# EAGLE design LightSwitch (EAGLE 9.1.3)
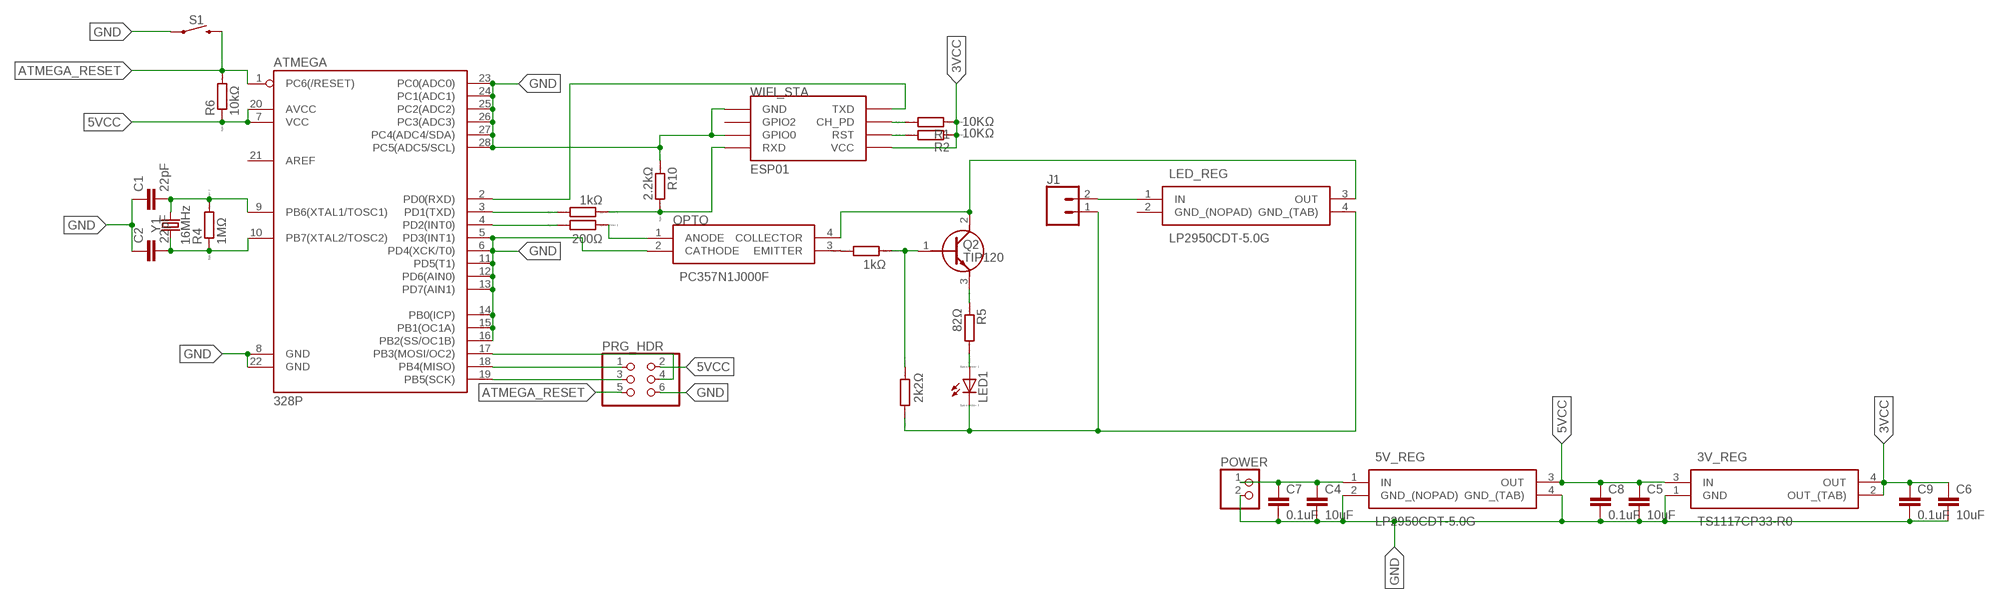
[diagram p0: schematic, sheet 1]

## Parts
3V_REG  TS1117CP33-R0  [TO229P990X238-4N]
5V_REG  LP2950CDT-5.0G  [TO229P990X238-4N]
ATMEGA  328P  ATMEGA328P_PDIP  [DIP28]
C1  22pF  1.0UF-1206-50V-10%  [1206]
C2  22pF  1.0UF-1206-50V-10%  [1206]
C4  10uF  1.0UF-1206-50V-10%  [1206]
C5  10uF  1.0UF-1206-50V-10%  [1206]
C6  10uF  1.0UF-1206-50V-10%  [1206]
C7  0.1uF  1.0UF-1206-50V-10%  [1206]
C8  0.1uF  1.0UF-1206-50V-10%  [1206]
C9  0.1uF  1.0UF-1206-50V-10%  [1206]
J1  CONN_025MM  [SCREWTERMINAL-5MM-2]
LED1  LED_ELD260  [LED_LD260]
LED_REG  LP2950CDT-5.0G  [TO229P990X238-4N]
OPTO  PC357N1J000F  [SOP254P675X300-4N]
POWER  PINHD-1X2  [1X02]
PRG_HDR  PINHD-2X3  [2X03]
Q2  TIP120  [TO220]
R1  10KΩ  RR1210  [R1210]
R2  10KΩ  RR1210  [R1210]
R3  200Ω  RR1210  [R1210]
R4  1MΩ  RR1210  [R1210]
R5  82Ω  RR1210  [R1210]
R6  10kΩ  RR1210  [R1210]
R7  1kΩ  RR1210  [R1210]
R8  2k2Ω  RR1210  [R1210]
R9  1kΩ  RR1210  [R1210]
R10  2.2kΩ  RR1210  [R1210]
S1  MOMENTARY-SWITCH-SPST-PTH-6.0MM  [TACTILE_SWITCH_PTH_6.0MM]
WIFI_STA  ESP01  [ESP01]
Y1  16MHz  CRYSTAL-8MHZSMD-HC49UP  [HC49UP]

## Nets
3VCC [power]: 3V_REG.2(OUT_(TAB)) 3V_REG.4(OUT) C6.1 C9.1 R1.1 R2.1 WIFI_STA.VCC
5VCC [power]: 3V_REG.3(IN) 5V_REG.3(OUT) ATMEGA.7(VCC) ATMEGA.20(AVCC) C5.1 C8.1 PRG_HDR.2 R6.1
AT_TXD: ATMEGA.3(PD1(TXD)) R9.2
ATMEGA_RESET: ATMEGA.1(PC6(/RESET)) PRG_HDR.5 R6.2 S1.3
GND [power]: 3V_REG.1(GND) 5V_REG.2(GND_(NOPAD)) 5V_REG.4(GND_(TAB)) ATMEGA.5(PD3(INT1)) ATMEGA.6(PD4(XCK/T0)) ATMEGA.8(GND) ATMEGA.11(PD5(T1)) ATMEGA.12(PD6(AIN0)) ATMEGA.13(PD7(AIN1)) ATMEGA.14(PB0(ICP)) ATMEGA.15(PB1(OC1A)) ATMEGA.16(PB2(SS/OC1B)) ATMEGA.22(GND) ATMEGA.23(PC0(ADC0)) ATMEGA.24(PC1(ADC1)) ATMEGA.25(PC2(ADC2)) ATMEGA.26(PC3(ADC3)) ATMEGA.27(PC4(ADC4/SDA)) ATMEGA.28(PC5(ADC5/SCL)) C1.1 C2.1 C4.2 C5.2 C6.2 C7.2 C8.2 C9.2 OPTO.2(CATHODE) POWER.2 PRG_HDR.6 R10.1 S1.1 WIFI_STA.GND WIFI_STA.GPIO0
LED_ANODE: LED1.A R5.2
LED_EN: ATMEGA.4(PD2(INT0)) R3.2
LED_GND [power]: J1.1 LED1.K(C) LED_REG.4(GND_(TAB)) R8.2
LED_VCC [power]: LED_REG.3(OUT) OPTO.4(COLLECTOR) Q2.2(C)
LED_VIN: J1.2 LED_REG.1(IN)
MISO: ATMEGA.18(PB4(MISO)) PRG_HDR.1
MOSI: ATMEGA.17(PB3(MOSI/OC2)) PRG_HDR.4
N$1: OPTO.3(EMITTER) R7.2
N$4: Q2.3(E) R5.1
OPTO_ANODE: OPTO.1(ANODE) R3.1
OPTO_EMITTER: Q2.1(B) R7.1 R8.1
SCK: ATMEGA.19(PB5(SCK)) PRG_HDR.3
STA_CH_PD: R1.2 WIFI_STA.CH_PD
STA_RST: R2.2 WIFI_STA.RST
STA_RXD: R9.1 R10.2 WIFI_STA.RX(RXD)
STA_TXD: ATMEGA.2(PD0(RXD)) WIFI_STA.TX(TXD)
VIN [power]: 5V_REG.1(IN) C4.1 C7.1 POWER.1
XTAL1: ATMEGA.9(PB6(XTAL1/TOSC1)) C1.2 R4.2 Y1.2
XTAL2: ATMEGA.10(PB7(XTAL2/TOSC2)) C2.2 R4.1 Y1.1
Unconnected: ATMEGA.21(AREF) WIFI_STA.GPIO2

## Power pins joined to a net without a drawn wire
GND_(NOPAD): LED_REG.2(GND_(NOPAD))

## Library data of the parts
3V_REG = TS1117CP33-R0:TS1117CP33-R0: Source: Datasheet <http://www.onsemi.com/pub/Collateral/LP2950-D.PDF>; ALLIED_NUMBER: 70100442; ALLIED_PRICE-STOCK: http://www.alliedelec.com/on-semiconductor-lp2950cdt-5-0g/70100442/; HEIGHT: 2.38mm; MANUFACTURER_NAME: ON Semiconductor; MANUFACTURER_PART_NUMBER: LP2950CDT-5.0G; MOUSER_PART_NUMBER: 863-LP2950CDT-5.0G; MOUSER_PRICE-STOCK: https://www.mouser.com/Search/Refine.aspx?Keyword=863-LP2950CDT-5.0G; RS_PART_NUMBER: 0463593P; RS_PRICE-STOCK: http://uk.rs-online.com/web/p/products/0463593P
5V_REG LED_REG = LP2950CDT-5.0G:LP2950CDT-5.0G: Source: Datasheet <http://www.onsemi.com/pub/Collateral/LP2950-D.PDF>; ALLIED_NUMBER: 70100442; ALLIED_PRICE-STOCK: http://www.alliedelec.com/on-semiconductor-lp2950cdt-5-0g/70100442/; HEIGHT: 2.38mm; MANUFACTURER_NAME: ON Semiconductor; MANUFACTURER_PART_NUMBER: LP2950CDT-5.0G; MOUSER_PART_NUMBER: 863-LP2950CDT-5.0G; MOUSER_PRICE-STOCK: https://www.mouser.com/Search/Refine.aspx?Keyword=863-LP2950CDT-5.0G; RS_PART_NUMBER: 0463593P; RS_PRICE-STOCK: http://uk.rs-online.com/web/p/products/0463593P
ATMEGA = SparkFun-IC-Microcontroller:ATMEGA328P_PDIP: Atmel 328P Through hole ATMEGA328P uC used in the Arduino 32kb flash, 1k EEPROM, 2k SRAM Datasheet <http://www.sparkfun.com/datasheets/Components/SMD/ATMega328.pdf> SparkFun Products Storefront component: AVR 28 Pin 20MHz 32K 6A/D - ATMega328P <https://www.sparkfun.com/products/9061> (COM-09061) SparkFun Simon Says - Through-Hole Soldering Kit <https://www.sparkfun.com/products/10547> (KIT-10547) SparkFun Learn to Solder - Simon Says <https://www.sparkfun.com/products/13708> (KIT-13708) SparkFun BigTime Watch Kit <https://www.sparkfun.com/products/11734> (KIT-11734) SparkFun ClockIt <https://www.sparkfun.com/products/10930> (KIT-10930) SparkFun Serial Enabled LCD Kit <https://www.sparkfun.com/products/10097> (LCD-10097) SparkFun Simon Tilts - Through Hole Soldering Kit <https://www.sparkfun.com/products/12634> (KIT-12634) SparkFun Frequency Counter Kit <https://www.sparkfun.com/products/10140> (KIT-10140) FabFM Radio Kit <https://www.sparkfun.com/products/11043> (KIT-11043) SparkFun Binary Blaster Kit <https://www.sparkfun.com/products/12037> (KIT-12037) SparkFun Metro-Gnome <https://www.sparkfun.com/products/9236> (KIT-09236) ATmega328 with Arduino Optiboot (Uno) <https://www.sparkfun.com/products/10524> (DEV-10524); PROD_ID: IC-09136
C1 C2 C4-C9 = SparkFun-Capacitors:1.0UF: 1µF ceramic capacitors A capacitor is a passive two-terminal electrical component used to store electrical energy temporarily in an electric field.; PROD_ID: CAP-09822; VALUE: 1.0uF
J1 = SparkFun-Connectors:CONN_02: Multi connection point. Often used as Generic Header-pin footprint for 0.1 inch spaced/style header connections On any of the 0.1 inch spaced packages, you can populate with these: Break Away Headers - Straight <https://www.sparkfun.com/products/116> (PRT-00116) Break Away Male Headers - Right Angle <https://www.sparkfun.com/products/553> (PRT-00553) Female Headers <https://www.sparkfun.com/products/115> (PRT-00115) Break Away Headers - Machine Pin <https://www.sparkfun.com/products/117> (PRT-00117) Break Away Female Headers - Swiss Machine Pin <https://www.sparkfun.com/products/743> (PRT-00743) For SCREWTERMINALS and SPRING TERMINALS visit here: Screw Terimnals on SparkFun.com <https://www.sparkfun.com/search/results?term=Screw+Terminals> (5mm/3.5mm/2.54mm spacing) This device is also useful as a general connection point to wire up your design to another part of your project. Our various solder wires solder well into these plated through hole pads. Hook-Up Wire - Assortment (Stranded, 22 AWG) <https://www.sparkfun.com/products/11375> (PRT-11375) Hook-Up Wire - Assortment (Solid Core, 22 AWG) <https://www.sparkfun.com/products/11367> (PRT-11367) View the entire wire category on our website here <https://www.sparkfun.com/categories/141> Special notes: Molex polarized connector foot print use with: PRT-08233 with associated crimp pins and housings. 2.54_SCREWTERM for use with PRT-10571. 3.5mm Screw Terminal footprints for PRT-08084 5mm Screw Terminal footprints for use with PRT-08432; SF_SKU: PRT-08432
LED1 = eagle-ltspice:LED_E: LED Source: http://www.osram.convergy.de Source: www.luxeon.com Source: www.kingbright.com; SPICEMODEL: NONE; SPICEPREFIX: D; SPICETYPE: diode
OPTO = PC357N1J000F:PC357N1J000F: Sharp, PC357N1J000F AC Input Transistor Output Optocoupler, Surface Mount, 4-Pin Mini-Flat Source: Datasheet <https://www.sharpsde.com/products/optoelectronic-components/model/PC357N1J000F/>; DESCRIPTION: Sharp, PC357N1J000F AC Input Transistor Output Optocoupler, Surface Mount, 4-Pin Mini-Flat; HEIGHT: 3mm; MANUFACTURER_NAME: Sharp Microelectronics; MANUFACTURER_PART_NUMBER: PC357N1J000F; MOUSER_PART_NUMBER: 852-PC357N1J000F; MOUSER_PRICE-STOCK: https://www.mouser.com/Search/Refine.aspx?Keyword=852-PC357N1J000F; RS_PART_NUMBER: 1460767; RS_PRICE-STOCK: http://uk.rs-online.com/web/p/products/1460767
POWER = pinhead:PINHD-1X2: PIN HEADER
PRG_HDR = pinhead:PINHD-2X3: PIN HEADER
Q2 = TIP120:TIP120: NPN Darlington Transistor Source: Datasheet <https://www.fairchildsemi.com/datasheets/TI/TIP120.pdf>; DESCRIPTION: NPN Darlington Transistor; HEIGHT: mm; MANUFACTURER_NAME: Fairchild Semiconductor; MANUFACTURER_PART_NUMBER: TIP120; MOUSER_PART_NUMBER: 512-TIP120; MOUSER_PRICE-STOCK: https://www.mouser.com/Search/Refine.aspx?Keyword=512-TIP120
R1-R10 = eagle-ltspice:R: RESISTOR, European symbol; SPICEMODEL: NONE; SPICEPREFIX: R
S1 = SparkFun-Switches:MOMENTARY-SWITCH-SPST: Momentary Switch (Pushbutton) - SPST Normally-open (NO) SPST momentary switches (buttons, pushbuttons). Variants PTH-12MM - 12mm square, through-hole Momentary Pushbutton Switch - 12mm Square <https://www.sparkfun.com/products/9190> (COM-09190) PTH-6.0MM, PTH-6.0MM-KIT - 6.0mm square, through-hole Mini Pushbutton Switch <https://www.sparkfun.com/products/97> (COM-00097) KIT package intended for soldering kit's - only one side of pads' copper is exposed. PTH-RIGHT-ANGLE-KIT - Right-angle, through-hole Right Angle Tactile Button <https://www.sparkfun.com/products/10791> - Used on SparkFun BigTime Watch Kit <https://www.sparkfun.com/products/11734> SMD-12MM - 12mm square, surface-mount Tactile Button - SMD (12mm) <https://www.sparkfun.com/products/12993> (COM-12993) Used on SparkFun PicoBoard <https://www.sparkfun.com/products/11888> SMD-4.5MM - 4.5mm Square Trackball Switch Used on SparkFun Blackberry Trackballer Breakout <https://www.sparkfun.com/products/13169> SMD-4.6MMX2.8MM - 4.60mm x 2.80mm, surface mount Used on SparkFun SAMD21 Mini Breakout <https://www.sparkfun.com/products/13664> SMD-5.2MM, SMD-5.2-REDUNDANT - 5.2mm square, surface-mount Mini Pushbutton Switch - SMD <https://www.sparkfun.com/products/8720> (COM-08720) Used on Arduino Pro Mini <https://www.sparkfun.com/products/11114> REDUNDANT package connects both switch circuits together SMD-6.0X3.5MM - 6.0 x 3.5mm, surface mount Momentary Reset Switch SMD <https://www.sparkfun.com/products/8229> (COM-08229) SMD-6.2MM-TALL - 6.2mm square, surface mount Tactile Button - SMD (6mm) <https://www.sparkfun.com/products/12992> Used on SparkFun Digital Sandbox <https://www.sparkfun.com/products/12651> SMD-RIGHT-ANGLE - Right-angle, surface mount Used on SparkFun Block for Intel® Edison - Arduino <https://www.sparkfun.com/products/13036>; PROD_ID: SWCH-08441; SF_SKU: COM-00097
WIFI_STA = esp8266modules:ESP01: ESP8266 Wifi module 01
Y1 = SparkFun-Clocks:CRYSTAL-8MHZ: 8MHz Crystal Datasheet Example <http://www.futureelectronics.com/en/technologies/electromechanical/timing-devices/crystals/Pages/6008189-ABM3B-8.000MHZ-B2-T.aspx?IM=0> Frequency: 8MHz Frequency Tolerance: ±20ppm Load Capacitance: 18pF SparkFun Products: Pro Micro -3.3V/8MHz <https://www.sparkfun.com/products/12587> WAV Trigger <https://www.sparkfun.com/products/13660>; PROD_ID: XTAL-11706; VALUE: 8MHz

## Net classes
0 default: width 0.406 mm, drill 0.203 mm, clearance 0.203 mm
1 power: width 0.813 mm, drill 0.203 mm, clearance 0.203 mm
2 text: width 0.203 mm, drill 0.203 mm, clearance 0.203 mm

## Board
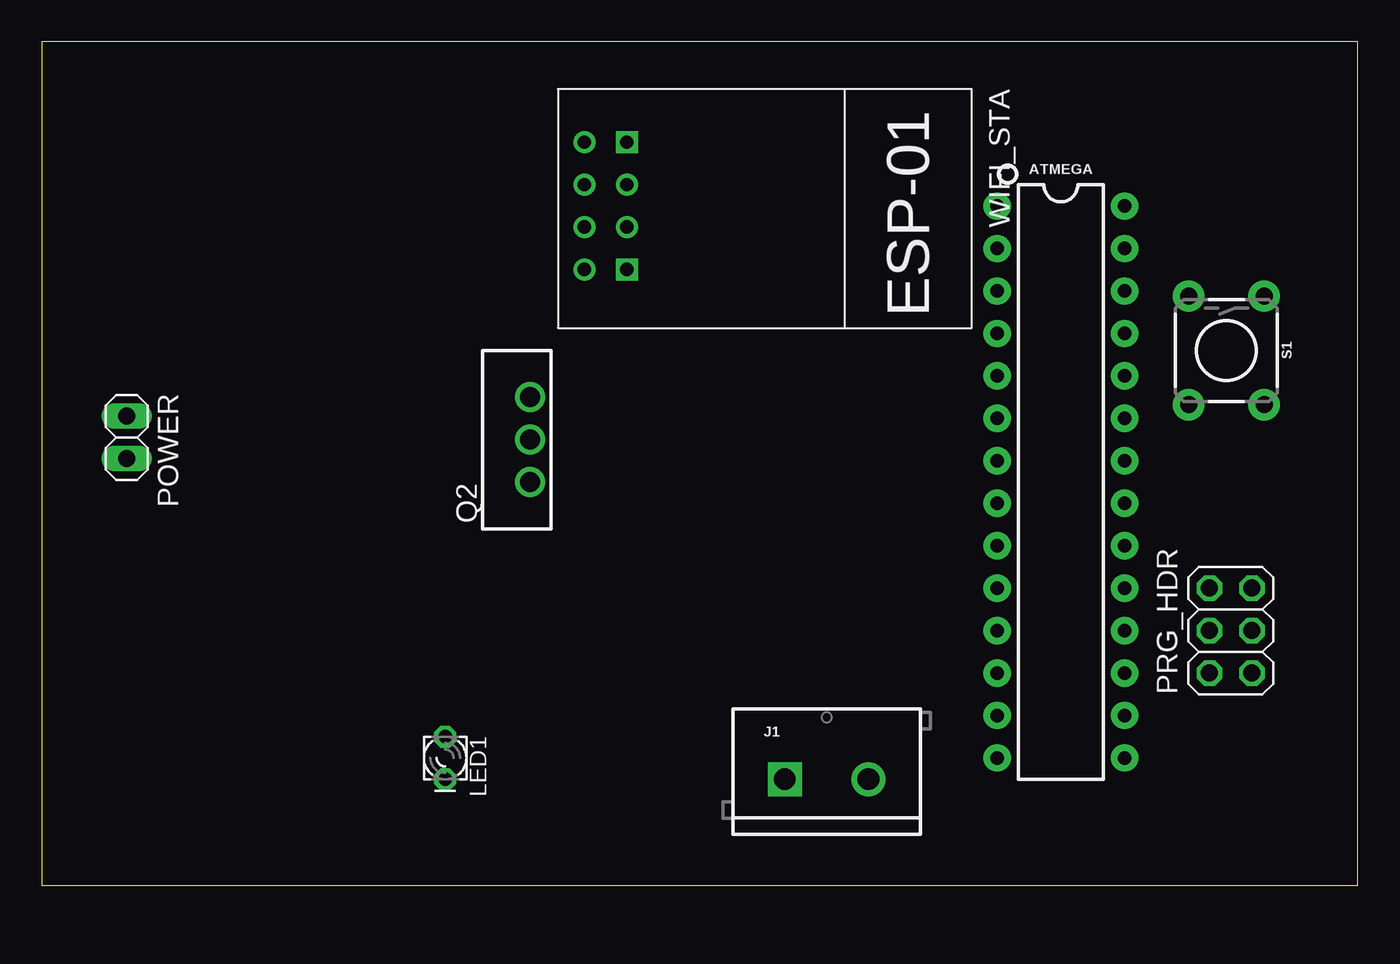
[diagram p1: board, top side]
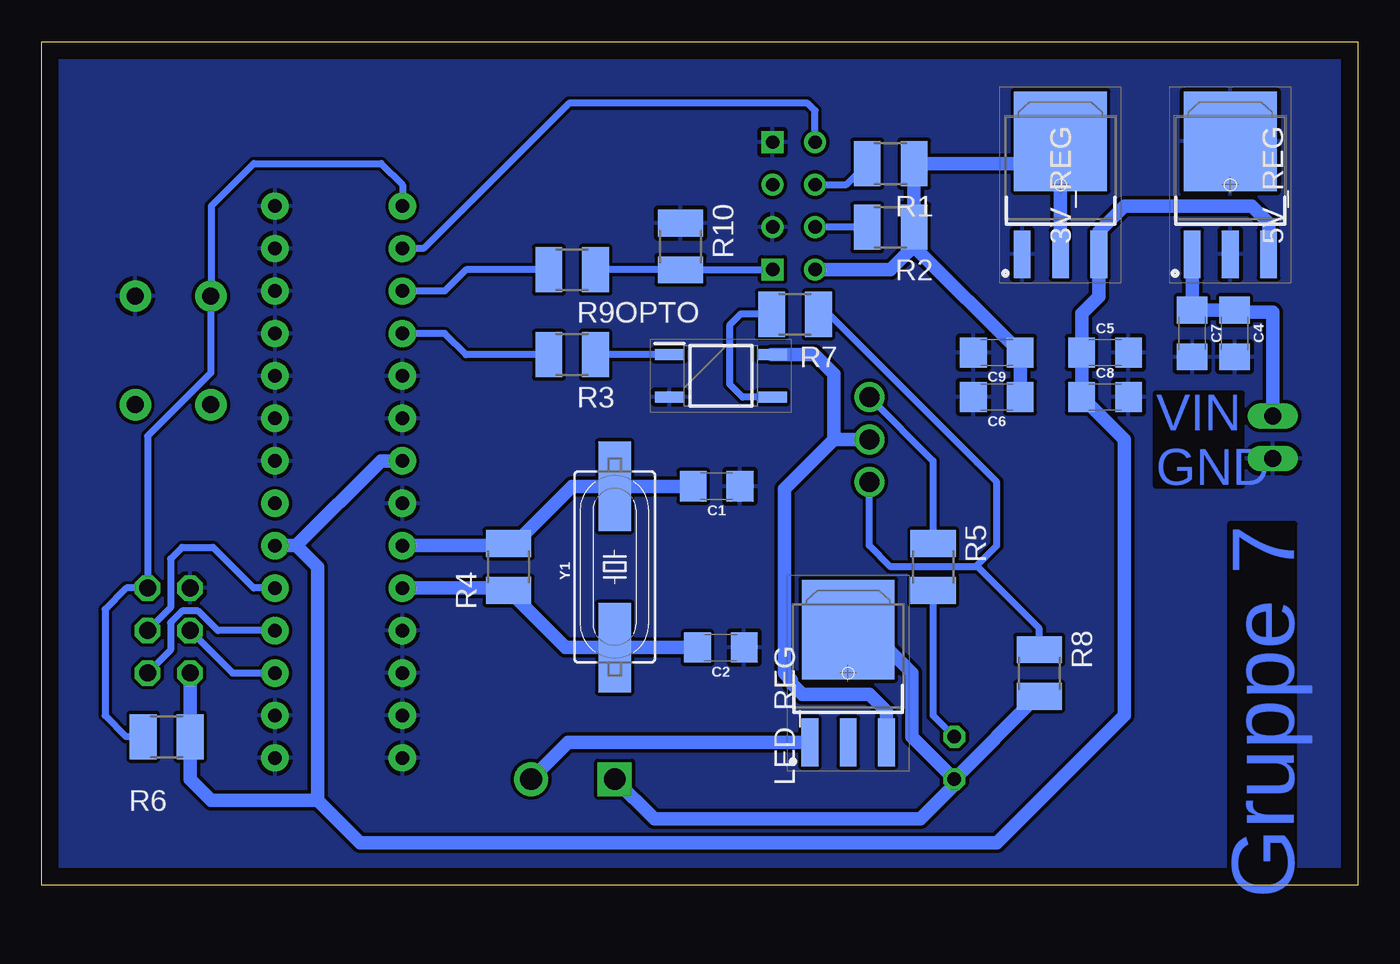
[diagram p2: board, bottom side, seen from below]

Size 78.72 x 50.47 mm. Coordinates in mm from the lower left corner, seen from the top.
Outline: 0,0 78.72,0 78.72,50.47 0,50.47 0,0
Copper layers (1*16): Top 0.035mm / dielectric 1.5mm / Bottom 0.035mm
Design rules "default *": minimum track width 6mil, minimum drill 0.35mm, track to track 6mil, track to pad 6mil, pad to pad 6mil, via to via 6mil, smd to smd 6mil, copper to edge 40mil, drill to drill 6mil, minimum pad ring 10mil, minimum via ring 8mil, stop-mask expansion 4mil, vias tented up to drill 0mil, thermal gap 10mil

### Footprints (pad centres in the part's own frame; a part is rotated, then mirrored left to right if it is on the bottom)
TO229P990X238-4N = smd 2.85 x 1: 1 -4.15,2.29; 2 -4.15,0; 3 -4.15,-2.29 | smd 5.95 x 5.55: 4 2.6,0
DIP28 = drill 0.813 pad 1.626: 1 -16.51,-3.81; 2 -13.97,-3.81; 3 -11.43,-3.81; 4 -8.89,-3.81; 5 -6.35,-3.81; 6 -3.81,-3.81; 7 -1.27,-3.81; 8 1.27,-3.81; 9 3.81,-3.81; 10 6.35,-3.81; 11 8.89,-3.81; 12 11.43,-3.81; 13 13.97,-3.81; 14 16.51,-3.81; 15 16.51,3.81; 16 13.97,3.81; 17 11.43,3.81; 18 8.89,3.81; 19 6.35,3.81; 20 3.81,3.81; 21 1.27,3.81; 22 -1.27,3.81; 23 -3.81,3.81; 24 -6.35,3.81; 25 -8.89,3.81; 26 -11.43,3.81; 27 -13.97,3.81; 28 -16.51,3.81
1206 = smd 1.6 x 1.8: 1 -1.4,0; 2 1.4,0
SCREWTERMINAL-5MM-2 = drill 1.3 pad 2.032 square: 1 0,0 | drill 1.3 pad 2.032: 2 5,0
LED_LD260 = drill 0.813 octagon: A -1.27,0; K 1.27,0
SOP254P675X300-4N = smd 1.75 x 0.65: 1 -3.075,1.27; 2 -3.075,-1.27; 3 3.075,-1.27; 4 3.075,1.27
1X02 = drill 1.016 long: 1 -1.27,0; 2 1.27,0
2X03 = drill 1.016 octagon: 1 -2.54,-1.27; 2 -2.54,1.27; 3 0,-1.27; 4 0,1.27; 5 2.54,-1.27; 6 2.54,1.27
TO220 = drill 1.2 pad 1.8: 1 -2.54,0; 2 0,0; 3 2.54,0
R1210 = smd 1.6 x 2.7: 1 -1.4,0; 2 1.4,0
TACTILE_SWITCH_PTH_6.0MM = drill 1.016 pad 1.88: 1 -3.251,2.261; 2 3.251,2.261; 3 -3.251,-2.261; 4 3.251,-2.261
ESP01 = drill 0.8: CH_PD -1.285,-8.178; GPIO0 1.255,-5.638; GPIO2 -1.285,-5.638; RST 1.255,-8.178; TX -3.825,-8.178; VCC 3.795,-8.178 | drill 0.8 square: GND -3.825,-5.638; RX 3.795,-5.638
HC49UP = smd 5.334 x 1.93: 1 -4.826,0; 2 4.826,0

### Placement (x,y rotation side)
3V_REG  17.78,41.91 90 bottom
5V_REG  7.62,41.91 90 bottom
ATMEGA  60.96,24.13 270 top
C1  38.35,23.88 180 bottom
C2  38.1,14.22 180 bottom
C4  7.37,33.02 270 bottom
C5  15.11,31.88 0 bottom
C6  21.59,29.21 180 bottom
C7  9.91,33.02 270 bottom
C8  15.11,29.21 0 bottom
C9  21.59,31.88 180 bottom
J1  44.45,6.35 0 top
LED1  24.13,7.62 270 top
LED_REG  30.48,12.7 90 bottom
OPTO  38.1,30.48 0 bottom
POWER  5.08,26.8 270 top
PRG_HDR  71.12,15.24 90 top
Q2  29.21,26.67 90 top
R1  27.94,43.18 180 bottom
R2  27.94,39.37 180 bottom
R3  46.99,31.75 180 bottom
R4  50.8,19.05 90 bottom
R5  25.4,19.05 270 bottom
R6  71.25,8.89 180 bottom
R7  33.66,34.16 180 bottom
R8  19.05,12.7 270 bottom
R9  46.99,36.83 180 bottom
R10  40.51,38.23 270 bottom
S1  70.87,32 270 top
WIFI_STA  40.64,40.64 270 top
Y1  44.45,19.05 90 bottom

### Tracks (layer width: path | path; a pad name or v marks a point on that pad's centre or on a via)
3VCC
  Bottom 0.813: 3V_REG.2 3V_REG.4 19.11,43.18 R1.1 R2.1 | C6.1 C9.1 26.54,38.23 R2.1 | R2.1 26.67,39.24 | WIFI_STA.VCC 32.45,36.83 27.94,36.83 26.54,38.23 R2.1
5VCC
  Bottom 0.813: 16.51,31.75 C8.1 13.97,26.67 13.97,10.16 21.59,2.54 59.69,2.54 62.23,5.08 | 16.51,31.75 C5.1 | ATMEGA.7 58.42,25.4 63.5,20.32 | ATMEGA.20 63.5,20.32 | 63.5,20.32 62.23,19.05 62.23,5.08 | 62.23,5.08 68.58,5.08 69.85,6.35 R6.1 PRG_HDR.2 | 16.51,31.75 16.51,34.2 15.49,35.22 3V_REG.3 15.49,39.12 13.97,40.64 6.35,40.64 5.33,39.62 5V_REG.3
AT_TXD
  Bottom 0.406: R9.2 53.34,36.83 54.61,35.56 ATMEGA.3
ATMEGA_RESET
  Bottom 0.406: ATMEGA.1 57.15,41.91 58.42,43.18 66.04,43.18 68.58,40.64 68.58,35.28 S1.3 68.61,30.66 72.39,26.87 PRG_HDR.5 73.66,17.78 74.93,16.51 74.93,10.16 73.66,8.89 R6.2
GND
  pour Bottom: 0,50.8 78.74,50.8 78.74,0 0,0
LED_ANODE
  Bottom 0.406: R5.2 25.4,10.16 LED1.A
LED_EN
  Bottom 0.406: R3.2 53.34,31.75 54.61,33.02 ATMEGA.4
LED_GND
  Bottom 0.813: LED1.K 19.18,11.3 R8.2 | J1.1 42.08,3.97 26.17,3.97 24.13,6.01 LED1.K | LED1.K 26.67,8.89 26.67,12.7 29.27,15.3 LED_REG.4
LED_VCC
  Bottom 0.813: 31.32,26.67 Q2.2 | OPTO.4 32.48,31.75 31.32,30.59 31.32,26.67 | LED_REG.3 28.19,10.41 29.21,11.43 33.22,11.43 33.86,12.07 33.86,12.28 34.29,12.7 34.29,23.7 31.32,26.67
LED_VIN
  Bottom 0.813: LED_REG.1 47.25,8.55 J1.2
MISO
  Bottom 0.406: ATMEGA.18 68.2,15.24 69.37,16.41 70.33,16.41 71.02,15.72 71.02,14.07 PRG_HDR.1
MOSI
  Bottom 0.406: PRG_HDR.4 67.31,12.7 ATMEGA.17
N$1
  Bottom 0.406: R7.2 36.93,34.16 37.58,33.51 37.58,29.99 36.8,29.21 OPTO.3
N$4
  Bottom 0.406: Q2.3 25.4,25.4 R5.1
OPTO_ANODE
  Bottom 0.406: OPTO.1 R3.1
OPTO_EMITTER
  Bottom 0.406: R7.1 31.62,34.16 22.75,25.29 21.59,24.13 21.59,20.32 22.75,19.16 22.75,19.07 22.37,18.69 | 19.05,14.74 R8.1 19.05,15.37 21.1,17.42 22.37,18.69 | 22.37,18.69 22.73,19.05 27.94,19.05 29.21,20.32 Q2.1
SCK
  Bottom 0.406: ATMEGA.19 66.04,17.78 68.48,20.22 70.33,20.22 71.02,19.53 71.02,16.61 PRG_HDR.3
STA_CH_PD
  Bottom 0.406: WIFI_STA.CH_PD 30.6,41.92 R1.2
STA_RST
  Bottom 0.406: WIFI_STA.RST 32.39,39.37 29.85,39.37 R2.2
STA_RXD
  Bottom 0.406: WIFI_STA.RX 35.02,36.83 R10.2 R9.1
STA_TXD
  Bottom 0.406: WIFI_STA.TX 32.46,46.35 32.91,46.79 47.19,46.79 55.88,38.1 ATMEGA.2
VIN
  Bottom 0.813: POWER.1 5.08,34.29 7.24,34.29 C4.1 C7.1 5V_REG.1
XTAL1
  Bottom 0.813: C1.2 Y1.2 46.99,23.88 50.42,20.45 R4.2 50.93,20.32 ATMEGA.9
XTAL2
  Bottom 0.813: ATMEGA.10 50.93,17.78 R4.1 47.37,14.22 Y1.1 C2.2

### Text on the board
Bottom: VIN / GND | Gruppe 7